# Altium schematic sheet MeasureBlock.SchDoc: Relay Tester
size A4 portrait; Date: 2018.12.12; Author: Ivan Perehiniak; Address2: Ivan Perehiniak; Address3: iv.perehinik@gmail.com; Revision: 3; SheetNumber: 6; SheetTotal: 6
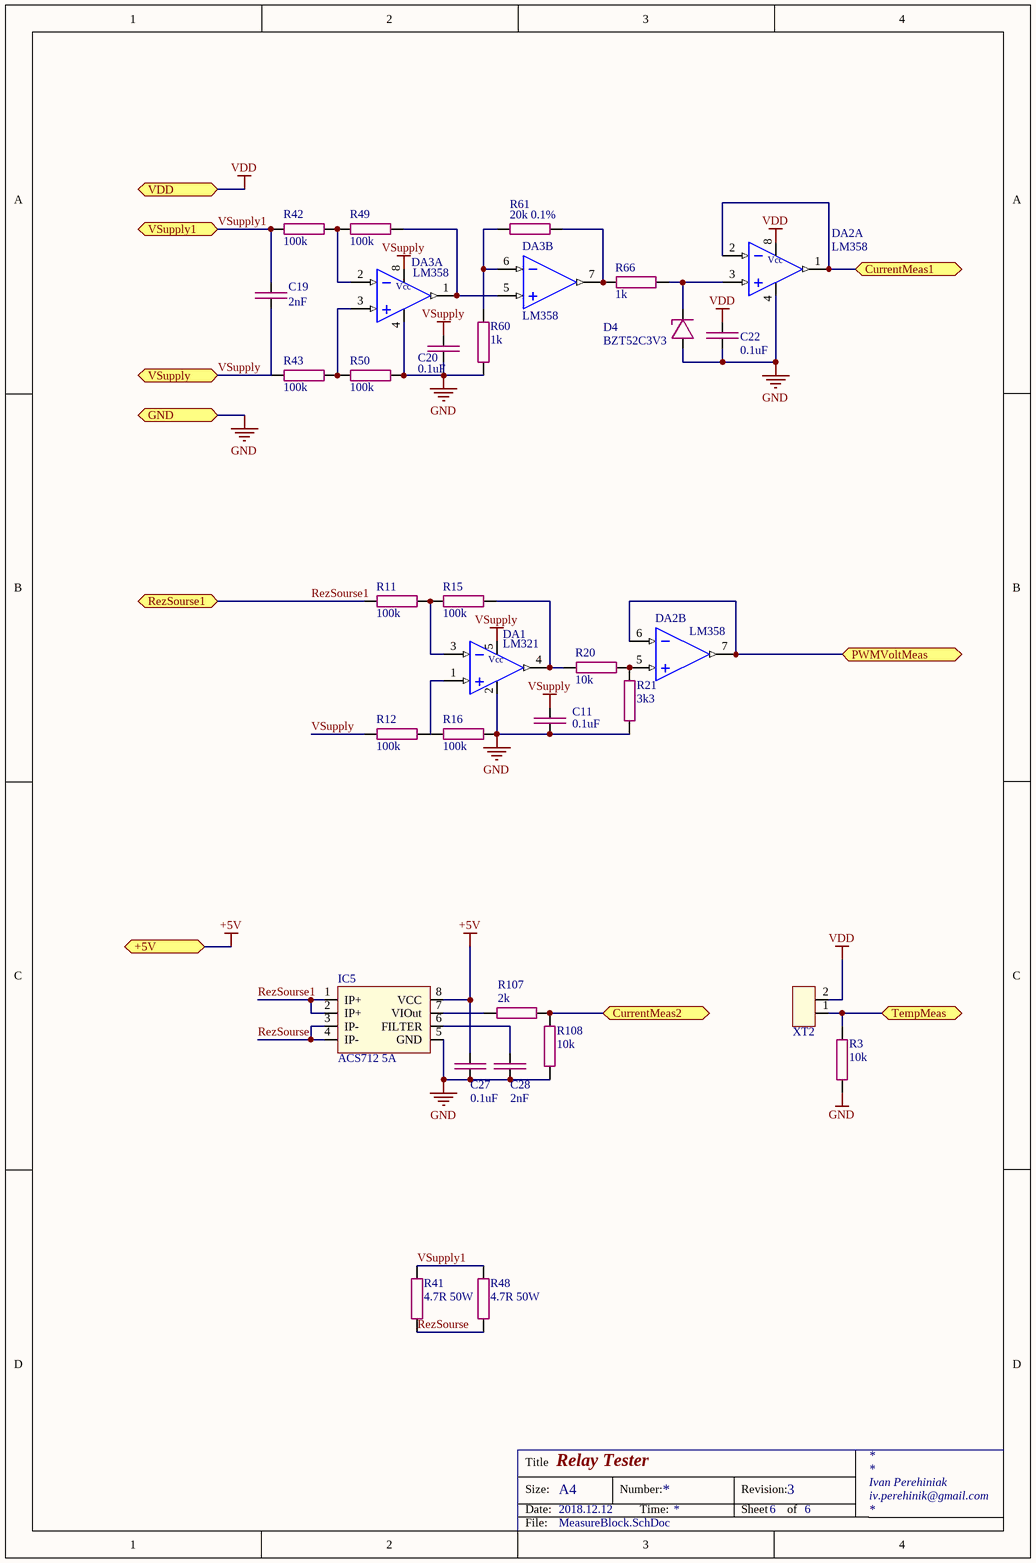
[diagram p0: MeasureBlock.SchDoc]

## Parts
C11  0.1uF  [C0603]
C19  2nF  [C0603]
C20  0.1uF  [C0603]
C22  0.1uF  [C0603]
C27  0.1uF  [C0603]
C28  2nF  [C0603]
D4  BZT52C3V3  [SOD123]
DA1  LM321  [SOT23-5]
DA2  LM358  [SOIC_N]  (parts A,B of 2)
DA3  LM358  [SOIC_N]  (parts A,B of 2)
IC5  ACS712 5A  [SOIC_N]
R3  10k  [R0603]
R11  100k  [R0603]
R12  100k  [R0603]
R15  100k  [R0603]
R16  100k  [R0603]
R20  10k  [R0603]
R21  3k3  [R0603]
R41  4.7R 50W  [TO-220-2-hor]
R42  100k  [R0603]
R43  100k  [R0603]
R48  4.7R 50W  [TO-220-2-hor]
R49  100k  [R0603]
R50  100k  [R0603]
R60  1k  [R0603]
R61  20k 0.1%  [R0603]
R66  1k  [R0603]
R107  2k  [R0603]
R108  10k  [R0603]
XT2  PLS-2  [PLS-2]  (value not drawn)

## Ports
+5V, CurrentMeas1, CurrentMeas2, GND, PWMVoltMeas, RezSourse1, TempMeas, VDD, VSupply, VSupply1

## Nets
+5V: C27.2 IC5.8(VCC) ; port +5V
GND: C11.1 C20.1 C22.1 C27.1 C28.1 D4.1(Anode) DA1.2(GND) DA2.4(GND) DA3.4(GND) IC5.5(GND) R3.1 R16.2 R21.1 R50.2 R60.1 R108.1 ; port GND
VDD: C22.2 DA2.8(Vcc) XT2.2 ; port VDD
VSupply: C11.2 C19.1 C20.2 DA1.5(Vcc) DA3.8(Vcc) R12.1 R43.1 ; port VSupply
CurrentMeas1: DA2.1(OUT1) DA2.2(IN1-) ; port CurrentMeas1
CurrentMeas2: R107.2 R108.2 ; port CurrentMeas2
PWMVoltMeas: DA2.6(IN2-) DA2.7(OUT2) ; port PWMVoltMeas
RezSourse: IC5.3(IP-) IC5.4(IP-) R41.2 R48.1
RezSourse1: IC5.1(IP+) IC5.2(IP+) R11.1 ; port RezSourse1
TempMeas: R3.2 XT2.1 ; port TempMeas
VSupply1: C19.2 R41.1 R42.1 R48.2 ; port VSupply1
NetC28_2: C28.2 IC5.6(FILTER)
NetD4_2: D4.2(Cathode) DA2.3(IN1+) R66.2
NetDA1_1: DA1.1(IN1+) R12.2 R16.1
NetDA1_3: DA1.3(IN1-) R11.2 R15.1
NetDA1_4: DA1.4(OUT1) R15.2 R20.2
NetDA2_5: DA2.5(IN2+) R20.1 R21.2
NetDA3_1: DA3.1(OUT1) DA3.5(IN2+) R49.2
NetDA3_2: DA3.2(IN1-) R42.2 R49.1
NetDA3_3: DA3.3(IN1+) R43.2 R50.1
NetDA3_6: DA3.6(IN2-) R60.2 R61.1
NetDA3_7: DA3.7(OUT2) R61.2 R66.1
NetIC5_7: IC5.7(VIOut) R107.1

## Notes on the sheet
- Title
- Size:
- Date:
- A4
- Number:
- Time:
- Revision:
- Sheet
- of
- File:

## Library data of the parts
C11 C20 C22 C27 = GMK316F475ZG-T: CAP CER 0.1UF 50V X7R 0603; Category: Capacitors; Manufacturer Part Number: GMK316F475ZG-T; Package / Case: 0603 (1608 Metric); ComponentLink1URL: https://search.kemet.com/component-edge/download/datasheet/C0603C104K5RACTU.pdf; ComponentLink1Description: https://search.kemet.com/component-edge/download/datasheet/C0603C104K5RACTU.pdf
C19 C28 = CL10B202KB8NNNC: CAP CER 2000PF 50V X7R 0603; Category: Capacitors; Manufacturer Part Number: CL10B202KB8NNNC; Package / Case: 0603 (1608 Metric); ComponentLink1URL: https://search.kemet.com/component-edge/download/datasheet/C0603C104K5RACTU.pdf; ComponentLink1Description: https://search.kemet.com/component-edge/download/datasheet/C0603C104K5RACTU.pdf; ComponentLink2URL: http://media.digikey.com/pdf/Data%20Sheets/Samsung%20PDFs/CL_Series_MLCC_ds.pdf; ComponentLink2Description: http://media.digikey.com/pdf/Data%20Sheets/Samsung%20PDFs/CL_Series_MLCC_ds.pdf
D4 = BZT52C3V3-7-F: Diode Zener Single 3.3V 6% 370mW 2-Pin SOD-123 T/R; Category: Discrete Semiconductor Products; Manufacturer Part Number: BZT52C3V3-7-F; Package / Case: SOD-123
DA1 = LM321: IC OPAMP GP 1.3MHZ RRO SOT23-5; Manufacturer Part Number: LMV321ILT; Category: Integrated Circuits (ICs); Package / Case: SC-74A, SOT-753
DA2 DA3 = LM358DT: Dual IC OPAMP GP 1.1MHZ 8SO; Category: Integrated Circuits (ICs); Manufacturer Part Number: LM358DT; Package / Case: 8-SOIC (0.154", 3.90mm Width); ComponentLink4URL: http://www.st.com/content/ccc/resource/technical/document/datasheet/61/46/87/01/98/ed/44/c5/CD00000464.pdf/files/CD00000464.pdf/jcr:content/translations/en.CD00000464.pdf; ComponentLink4Description: http://www.st.com/content/ccc/resource/technical/document/datasheet/61/46/87/01/98/ed/44/c5/CD00000464.pdf/files/CD00000464.pdf/jcr:content/translations/en.CD00000464.pdf
IC5 = ACS712ELCTR-05B: SENSOR CURRENT HALL 5A AC/DC; Manufacturer Part Number: ACS712ELCTR-05B-T; Category: Sensors, Transducers; Package / Case: 8-SOIC (0.154", 3.90mm Width)
R3 R20 R108 = CRCW060310K0FKTABC: RES SMD 10K OHM 1% 1/10W 0603; Category: Resistors; Package / Case: 0603 (1608 Metric); Manufacturer Part Number: CRCW060310K0FKTABC
R11 R12 R15 R16 R42 R43 R49 R50 = ERJ-S03J104V: RES SMD 100K OHM 5% 1/10W 0603; Category: Resistors; Package / Case: 0603 (1608 Metric); Manufacturer Part Number: ERJ-S03J104V; ComponentLink1URL: https://industrial.panasonic.com/cdbs/www-data/pdf/RDA0000/AOA0000C304.pdf; ComponentLink1Description: https://industrial.panasonic.com/cdbs/www-data/pdf/RDA0000/AOA0000C304.pdf; ComponentLink2URL: http://industrial.panasonic.com/www-cgi/jvcr13pz.cgi?E+PZ+3+AOA0005+ERJS03J101V+7+WW; ComponentLink2Description: http://industrial.panasonic.com/www-cgi/jvcr13pz.cgi?E+PZ+3+AOA0005+ERJS03J101V+7+WW; ComponentLink3URL: https://industrial.panasonic.com/cdbs/www-data/pdf/RDO0000/AOA0000C331.pdf; ComponentLink3Description: https://industrial.panasonic.com/cdbs/www-data/pdf/RDO0000/AOA0000C331.pdf
R21 = CRCW06033K30FKTABC: RES SMD 3.3K OHM 1% 1/10W 0603; Category: Resistors; Package / Case: 0603 (1608 Metric); Manufacturer Part Number: CRCW06033K30FKTABC
R41 R48 = RTO050F4R700JTE3: RES 4.7 OHM 50W 5% AXIAL; Category: Resistors; Package / Case: Axial; Manufacturer Part Number: RTO050F4R700JTE3
R60 R66 = ERJ-3GEYJ102V: RES SMD 1K OHM 5% 1/10W 0603; Category: Resistors; Package / Case: 0603 (1608 Metric); Manufacturer Part Number: ERJ-3GEYJ102V; ComponentLink1URL: https://industrial.panasonic.com/cdbs/www-data/pdf/RDA0000/AOA0000C304.pdf; ComponentLink1Description: https://industrial.panasonic.com/cdbs/www-data/pdf/RDA0000/AOA0000C304.pdf; ComponentLink2URL: http://industrial.panasonic.com/www-cgi/jvcr13pz.cgi?E+PZ+3+AOA0005+ERJS03J101V+7+WW; ComponentLink2Description: http://industrial.panasonic.com/www-cgi/jvcr13pz.cgi?E+PZ+3+AOA0005+ERJS03J101V+7+WW; ComponentLink3URL: https://industrial.panasonic.com/cdbs/www-data/pdf/RDO0000/AOA0000C331.pdf; ComponentLink3Description: https://industrial.panasonic.com/cdbs/www-data/pdf/RDO0000/AOA0000C331.pdf
R61 = ERA-3AEB203V: RES SMD 20K OHM 0.1% 1/10W 0603; Category: Resistors; Package / Case: 0603 (1608 Metric); Manufacturer Part Number: ERA-3AEB203V; ComponentLink1URL: https://industrial.panasonic.com/cdbs/www-data/pdf/RDA0000/AOA0000C304.pdf; ComponentLink1Description: https://industrial.panasonic.com/cdbs/www-data/pdf/RDA0000/AOA0000C304.pdf; ComponentLink2URL: https://industrial.panasonic.com/cdbs/www-data/pdf/RDM0000/AOA0000C307.pdf; ComponentLink2Description: https://industrial.panasonic.com/cdbs/www-data/pdf/RDM0000/AOA0000C307.pdf
R107 = CRCW06032K00FKTABC: RES SMD 2K OHM 1% 1/10W 0603; Category: Resistors; Package / Case: 0603 (1608 Metric); Manufacturer Part Number: CRCW06032K00FKTABC
XT2 = PLS-2: SIL VERTICAL PC TAIL PIN HEADER; Manufacturer Part Number: M20-9990246; Category: Connectors, Interconnects